# Altium schematic sheet Main.SchDoc
size A4
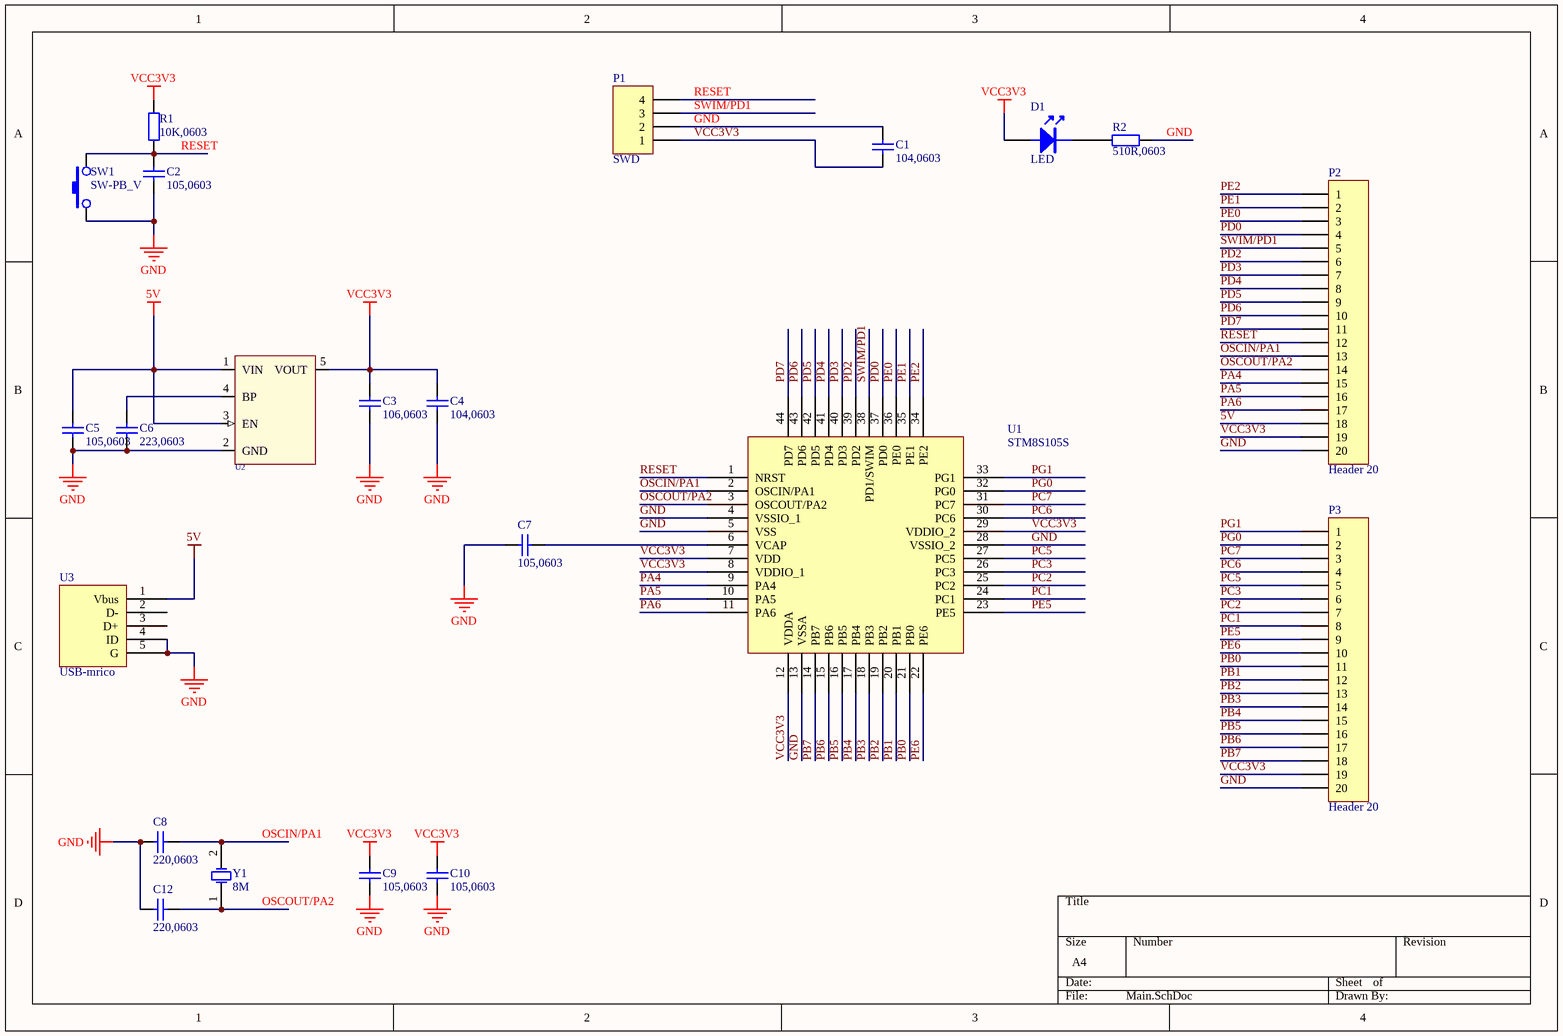
[diagram p0: Main.SchDoc]

## Parts
C1  104,0603  [C 0603]
C2  105,0603  [C 0603]
C3  106,0603  [C 0603]
C4  104,0603  [C 0603]
C5  105,0603  [C 0603]
C6  223,0603  [C 0603]
C7  105,0603  [C 0603]
C8  220,0603  [C 0603]
C9  105,0603  [C 0603]
C10  105,0603  [C 0603]
C12  220,0603  [C 0603]
D1  LED  [LED 0805G]
P1  SWD  [HDR-1X4_H]
P2  Header 20  [HDR1X20]
P3  Header 20  [HDR1X20]
R1  10K,0603  [R 0603]
R2  510R,0603  [R 0603]
SW1  SW-PB_V  [TSW SMD-3*6*2.5]
U1  STM8S105S  [LQFP44]
U2  RT9193  [SOT23-5L]  (value not drawn)
U3  USB-mrico  [USB-micro_B]
Y1  8M  [XTAL-5032]

## Nets
5V: C5.2 P2.18 U2.1(VIN) U2.3(EN) U3.1(Vbus)
GND: C1.2 C2.1 C3.2 C4.1 C5.1 C6.1 C7.2 C8.2 C9.1 C10.1 C12.2 P1.2 P2.20 P3.20 R2.2 SW1.1 U1.4(VSSIO_1) U1.5(VSS) U1.13(VSSA) U1.28(VSSIO_2) U2.2(GND) U3.4(ID) U3.5(G)
VCC3V3: C1.1 C3.1 C4.2 C9.2 C10.2 D1.1 P1.1 P2.19 P3.19 R1.2 U1.7(VDD) U1.8(VDDIO_1) U1.12(VDDA) U1.29(VDDIO_2) U2.5(VOUT)
OSCIN/PA1: C8.1 P2.13 U1.2(OSCIN/PA1) Y1.2(OSC2)
OSCOUT/PA2: C12.1 P2.14 U1.3(OSCOUT/PA2) Y1.1(OSC1)
PA4: P2.15 U1.9(PA4)
PA5: P2.16 U1.10(PA5)
PA6: P2.17 U1.11(PA6)
PB0: P3.11 U1.21(PB0)
PB1: P3.12 U1.20(PB1)
PB2: P3.13 U1.19(PB2)
PB3: P3.14 U1.18(PB3)
PB4: P3.15 U1.17(PB4)
PB5: P3.16 U1.16(PB5)
PB6: P3.17 U1.15(PB6)
PB7: P3.18 U1.14(PB7)
PC1: P3.8 U1.24(PC1)
PC2: P3.7 U1.25(PC2)
PC3: P3.6 U1.26(PC3)
PC5: P3.5 U1.27(PC5)
PC6: P3.4 U1.30(PC6)
PC7: P3.3 U1.31(PC7)
PD0: P2.4 U1.37(PD0)
PD2: P2.6 U1.39(PD2)
PD3: P2.7 U1.40(PD3)
PD4: P2.8 U1.41(PD4)
PD5: P2.9 U1.42(PD5)
PD6: P2.10 U1.43(PD6)
PD7: P2.11 U1.44(PD7)
PE0: P2.3 U1.36(PE0)
PE1: P2.2 U1.35(PE1)
PE2: P2.1 U1.34(PE2)
PE5: P3.9 U1.23(PE5)
PE6: P3.10 U1.22(PE6)
PG0: P3.2 U1.32(PG0)
PG1: P3.1 U1.33(PG1)
RESET: C2.2 P1.4 P2.12 R1.1 SW1.2 U1.1(NRST)
SWIM/PD1: P1.3 P2.5 U1.38(PD1/SWIM)
NetC6_2: C6.2 U2.4(BP)
NetC7_1: C7.1 U1.6(VCAP)
NetD1_2: D1.2 R2.1

Not connected (* = marked no-connect by the designer): U3 2(D-) 3(D+)

## Library data of the parts
C1-C10 C12 = Cap: Capacitor; Value: 104; Published: 8-Jun-2000; LatestRevisionDate: 17-Jul-2002; LatestRevisionNote: Re-released for DXP Platform.; Publisher: Altium Limited
P1 = Header 4: Header, 4-Pin; LatestRevisionDate: 17-Jul-2002; LatestRevisionNote: Re-released for DXP Platform.; Publisher: Altium Limited
P2 P3 = Header 20: Header, 20-Pin; LatestRevisionDate: 17-Jul-2002; LatestRevisionNote: Re-released for DXP Platform.; Publisher: Altium Limited
R1 R2 = Res2: Resistor; Published: 8-Jun-2000; LatestRevisionDate: 17-Jul-2002; LatestRevisionNote: Re-released for DXP Platform.; Publisher: Altium Limited
SW1 = SW-PB_V: SWITCH
U1 = STM8S105S4
U2 = RT9193X_5P: ICA_MFR_NAME: RICHTEK; ICA_PARTNUM: $$2191094$$RT9193-15CU5; Part Number: TMP-13
U3 = usb-STM
Y1 = XTAL: Crystal Oscillator; Published: 8-Jun-2000; LatestRevisionDate: 17-Jul-2002; LatestRevisionNote: Re-released for DXP Platform.; Publisher: Altium Limited